# EAGLE design Clock&Timer (EAGLE 9.6.2)
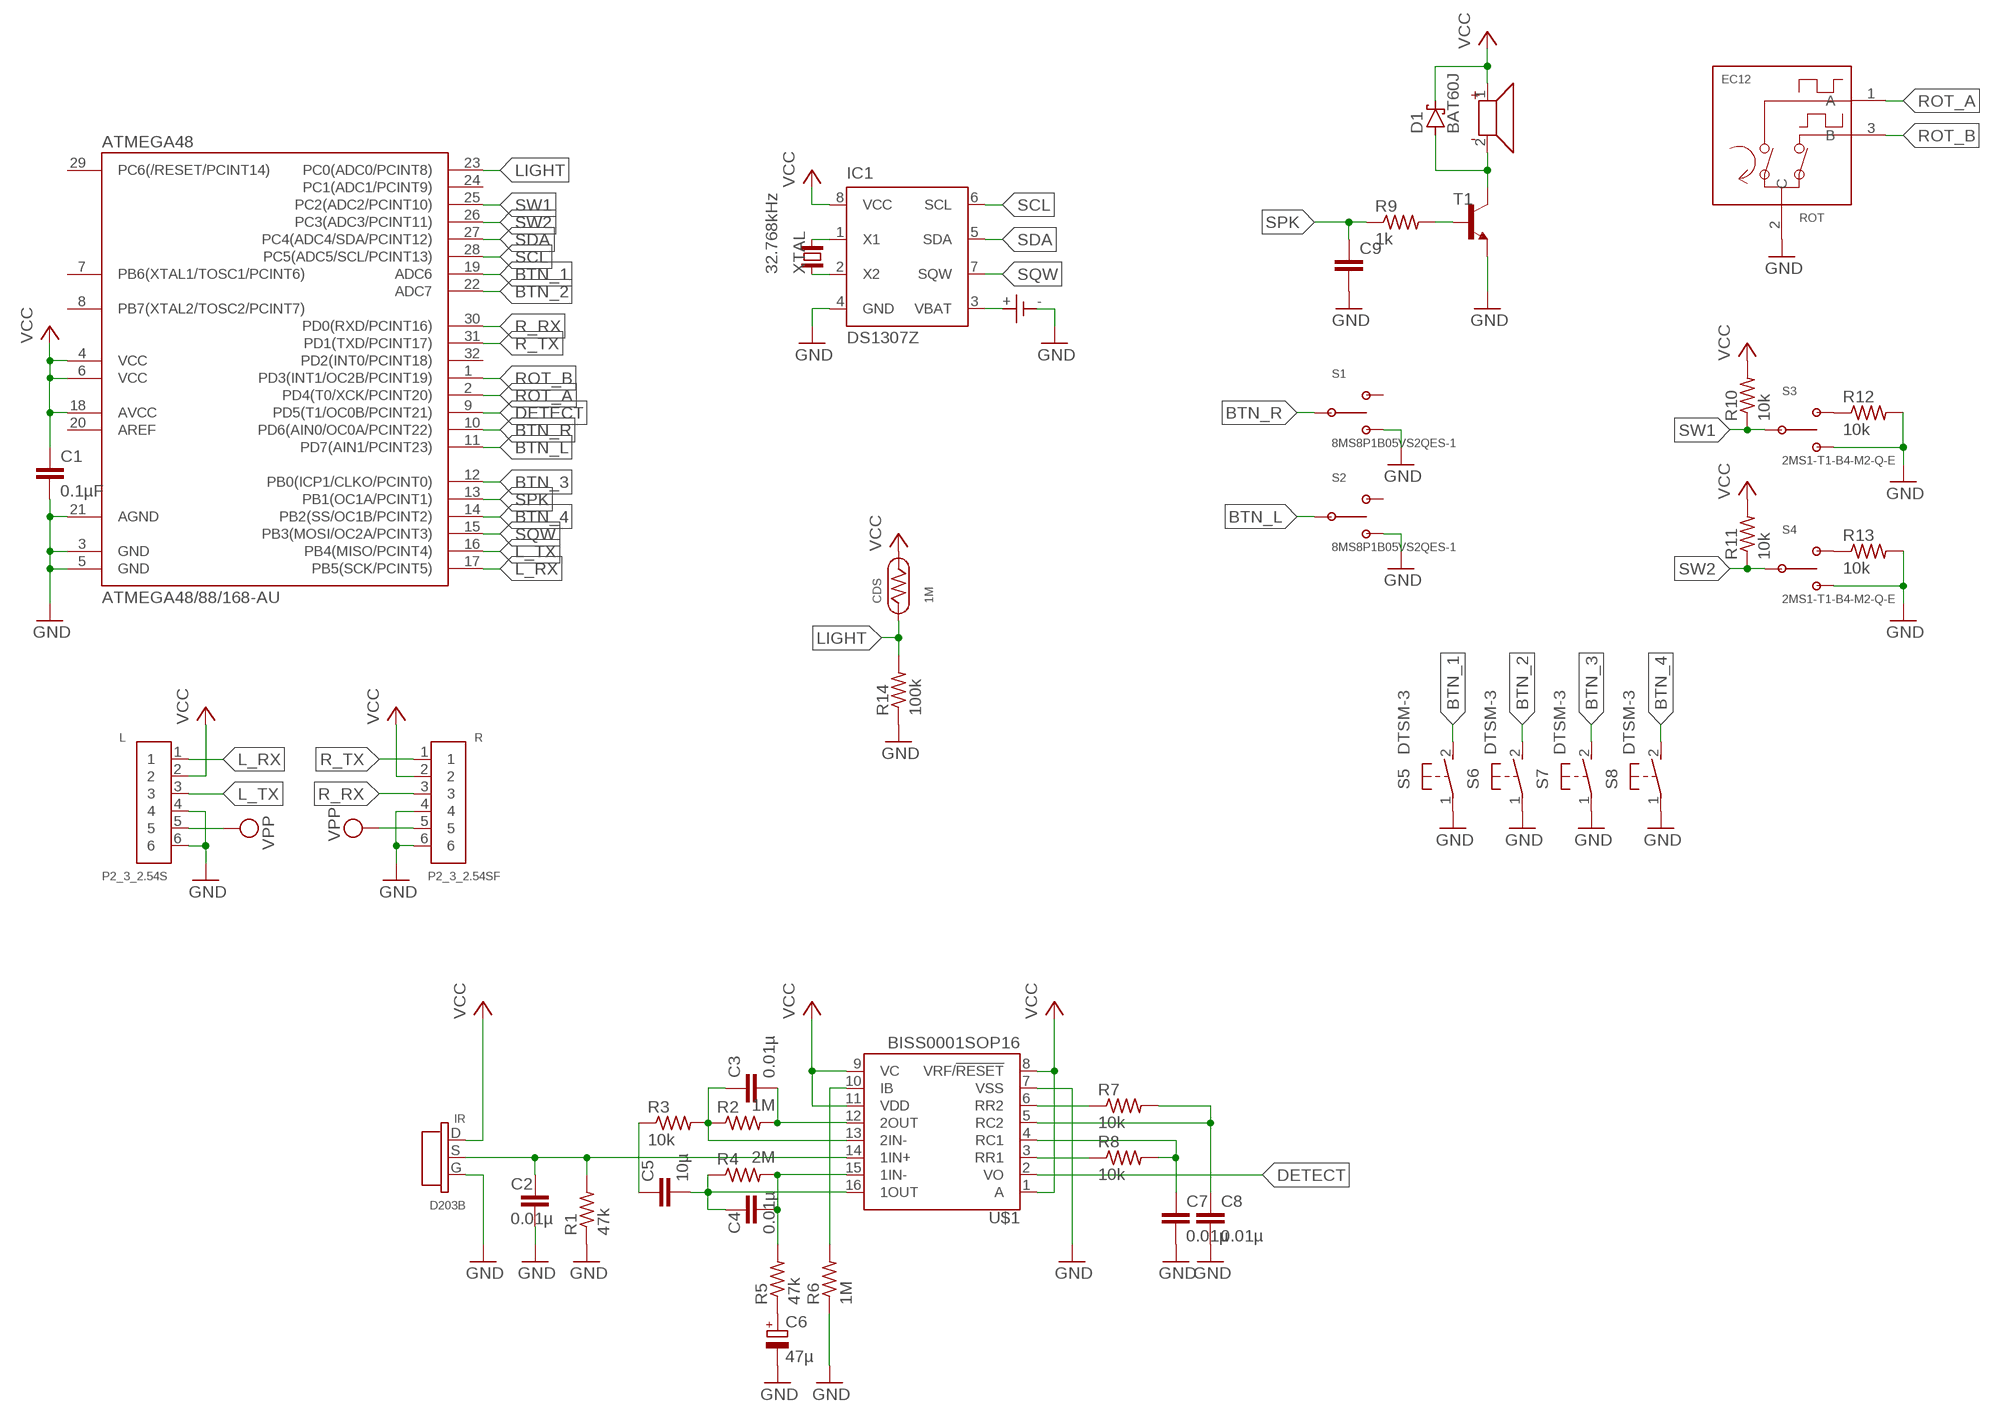
[diagram p0: schematic, sheet 1]

## Parts
ATMEGA48  ATMEGA48/88/168-AU  [TQFP32-08]
BAT  BC1/3N  [BC1/3N]
C1  0.1µF  C-EUC0603  [C0603]
C2  0.01µ  C-EUC0603  [C0603]
C3  0.01µ  C-EUC0603  [C0603]
C4  0.01µ  C-EUC0603  [C0603]
C5  10µ  C-EUC0603  [C0603]
C6  47µ  CPOL-EU153CLV-0605  [153CLV-0605]
C7  0.01µ  C-EUC0603  [C0603]
C8  0.01µ  C-EUC0603  [C0603]
C9  C-EUC0603  [C0603]
CDS  1M  GL55  [GL55]
D1  BAT60J  [SOD323_ST]
IC1  DS1307Z  [SOIC8]
IR  D203B  [D203B]
L  P2_3_2.54S  [P2_3_2.54S]
R  P2_3_2.54SF  [P2_3_2.54SF]
R1  47k  R-US_R0603  [R0603]
R2  1M  R-US_R0603  [R0603]
R3  10k  R-US_R0603  [R0603]
R4  2M  R-US_R0603  [R0603]
R5  47k  R-US_R0603  [R0603]
R6  1M  R-US_R0603  [R0603]
R7  10k  R-US_R0603  [R0603]
R8  10k  R-US_R0603  [R0603]
R9  1k  R-US_R0603  [R0603]
R10  10k  R-US_R0603  [R0603]
R11  10k  R-US_R0603  [R0603]
R12  10k  R-US_R0603  [R0603]
R13  10k  R-US_R0603  [R0603]
R14  100k  R-US_R0603  [R0603]
ROT  EC12  [EC12]
S1  8MS8P1B05VS2QES-1  [8MS8P1B05VS2QES-1]
S2  8MS8P1B05VS2QES-1  [8MS8P1B05VS2QES-1]
S3  2MS1-T1-B4-M2-Q-E  [2MS1-T1-B4-M2-Q-E]
S4  2MS1-T1-B4-M2-Q-E  [2MS1-T1-B4-M2-Q-E]
S5  DTSM-3  [DTSM-3]
S6  DTSM-3  [DTSM-3]
S7  DTSM-3  [DTSM-3]
S8  DTSM-3  [DTSM-3]
T1  -NPN-SOT23-EBC  [SOT23-EBC]
U$1  BISS0001SOP16  [SOP16]
U$9  UGCM0903EPD  [UGCM0903EPD]
XTAL  32.768kHz  CRYTALFC-255  [FC-255]

## Nets
BTN_1: ATMEGA48.19(ADC6) S5.2
BTN_2: ATMEGA48.22(ADC7) S6.2
BTN_3: ATMEGA48.12(PB0(ICP1/CLKO/PCINT0)) S7.2
BTN_4: ATMEGA48.14(PB2(SS/OC1B/PCINT2)) S8.2
BTN_L: ATMEGA48.11(PD7(AIN1/PCINT23)) S2.2(C)
BTN_R: ATMEGA48.10(PD6(AIN0/OC0A/PCINT22)) S1.2(C)
DETECT: ATMEGA48.9(PD5(T1/OC0B/PCINT21)) U$1.2(VO)
GND: ATMEGA48.3(GND) ATMEGA48.5(GND) ATMEGA48.21(AGND) BAT.-(V-) C1.2 C2.2 C6.- C7.2 C8.2 C9.2 IC1.4(GND) IR.G(GND) L.4 L.6 R1.1 R6.1 R12.2 R13.2 R14.1 R.4 R.6 ROT.2(C) S1.3(B) S2.3(B) S3.3(B) S4.3(B) S5.1 S6.1 S7.1 S8.1 T1.E U$1.7(VSS)
L_RX: ATMEGA48.17(PB5(SCK/PCINT5)) L.1
L_TX: ATMEGA48.16(PB4(MISO/PCINT4)) L.3
LIGHT: ATMEGA48.23(PC0(ADC0/PCINT8)) CDS.1 R14.2
N$1: C2.1 IR.S(OUTPUT) R1.2 U$1.14(1IN+)
N$2: C3.2 R2.2 U$1.12(2OUT)
N$3: C3.1 R2.1 R3.2 U$1.13(2IN-)
N$4: C4.2 R4.2 R5.2 U$1.15(1IN-)
N$5: C5.1 R3.1
N$6: C4.1 C5.2 R4.1 U$1.16(1OUT)
N$7: C6.+ R5.1
N$8: R6.2 U$1.10(IB)
N$9: R7.1 U$1.6(RR2)
N$10: C8.1 R7.2 U$1.5(RC2)
N$11: IC1.1(X1) XTAL.2
N$12: R8.1 U$1.3(RR1)
N$13: C7.1 R8.2 U$1.4(RC1)
N$14: D1.A T1.C U$9.2
N$15: R9.2 T1.B
N$16: IC1.2(X2) XTAL.1
N$19: R12.1 S3.1(A)
N$20: R13.1 S4.1(A)
R_RX: ATMEGA48.30(PD0(RXD/PCINT16)) R.3
R_TX: ATMEGA48.31(PD1(TXD/PCINT17)) R.1
ROT_A: ATMEGA48.2(PD4(T0/XCK/PCINT20)) ROT.1(A)
ROT_B: ATMEGA48.1(PD3(INT1/OC2B/PCINT19)) ROT.3(B)
SCL: ATMEGA48.28(PC5(ADC5/SCL/PCINT13)) IC1.6(SCL)
SDA: ATMEGA48.27(PC4(ADC4/SDA/PCINT12)) IC1.5(SDA)
SPK: ATMEGA48.13(PB1(OC1A/PCINT1)) C9.1 R9.1
SQW: ATMEGA48.15(PB3(MOSI/OC2A/PCINT3)) IC1.7(SQW)
SW1: ATMEGA48.25(PC2(ADC2/PCINT10)) R10.1 S3.2(C)
SW2: ATMEGA48.26(PC3(ADC3/PCINT11)) R11.1 S4.2(C)
VBAT: BAT.+(V+) IC1.3(VBAT)
VCC: ATMEGA48.4(VCC) ATMEGA48.6(VCC) ATMEGA48.18(AVCC) C1.1 CDS.2 D1.C IC1.8(VCC) IR.D(VIN) L.2 R10.2 R11.2 R.2 U$1.1(A) U$1.8(VRF/!RESET!) U$1.9(VC) U$1.11(VDD) U$9.1
VPP: L.5 R.5
Unconnected: ATMEGA48.7(PB6(XTAL1/TOSC1/PCINT6)) ATMEGA48.8(PB7(XTAL2/TOSC2/PCINT7)) ATMEGA48.20(AREF) ATMEGA48.24(PC1(ADC1/PCINT9)) ATMEGA48.29(PC6(/RESET/PCINT14)) ATMEGA48.32(PD2(INT0/PCINT18)) S1.1(A) S2.1(A)

## Library data of the parts
ATMEGA48 = atmega8:ATMEGA48/88/168
BAT = batteries:BC1/3N
C1 = rcl:C-EU: CAPACITOR, European symbol; SPICEPREFIX: C
C2-C5 C7-C9 = resistor:C-EU: CAPACITOR, European symbol
C6 = rcl:CPOL-EU: POLARIZED CAPACITOR, European symbol; SPICEPREFIX: C
CDS = cds:GL55
D1 = diode:BAT60J: Schottky barrier diode Source: www.st.com, BAT60J.pdf
IC1 = ds1307_pcf8583:DS1307: I2C-Bus CLOCK/CALENDAR
IR = pir:D203B
L = pins:P2_3_2.54S
R = pins:P2_3_2.54SF
R1-R8 R10-R14 = rcl:R-US_: RESISTOR, American symbol; SPICEPREFIX: R
R9 = resistor:R-US_: RESISTOR, American symbol
ROT = rotary-encoder:EC12
S1 S2 = switches:8MS8P1B05VS2QES-1
S3 S4 = switches:2MS1-T1-B4-M2-Q-E
S5-S8 = switch-tact:DTSM-3
T1 = transistor:*-NPN-: NPN Transistror BF959 corrected 2008.03.06
U$1 = pir:BISS0001
U$9 = speakers:UGCM0903EPD
XTAL = crystal':CRYTAL: CRYSTAL

## Board
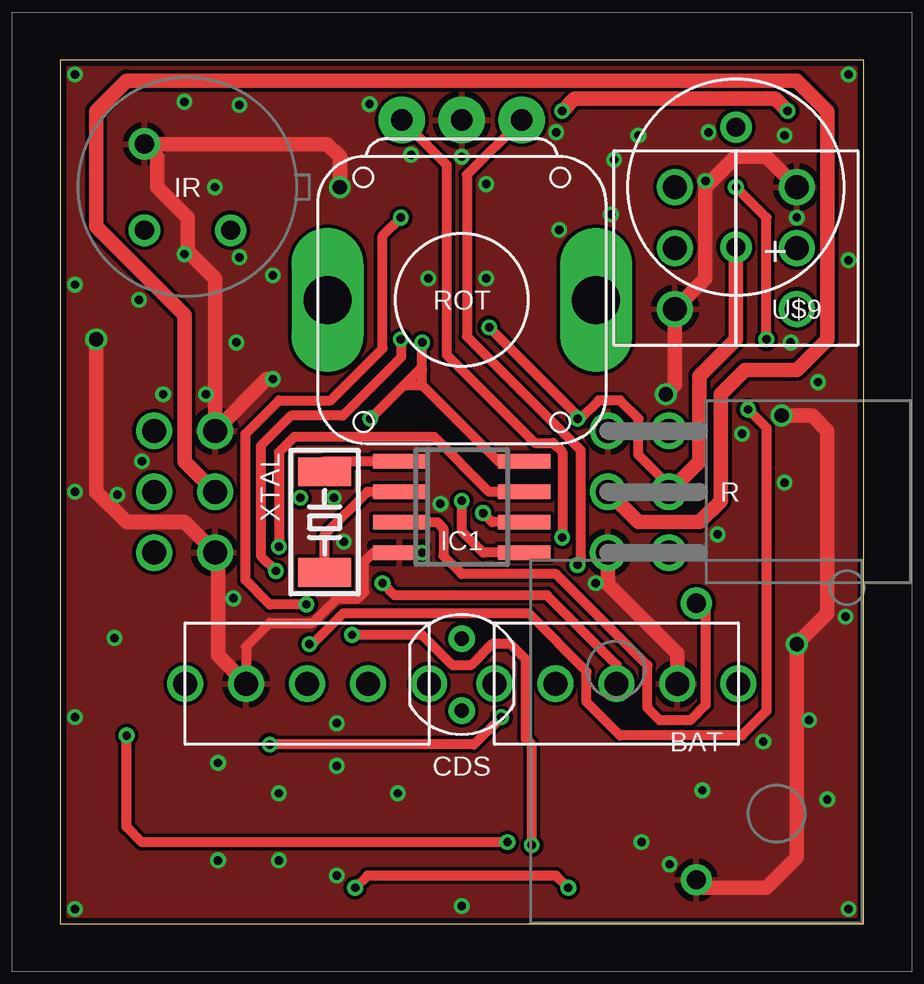
[diagram p1: board, top side]
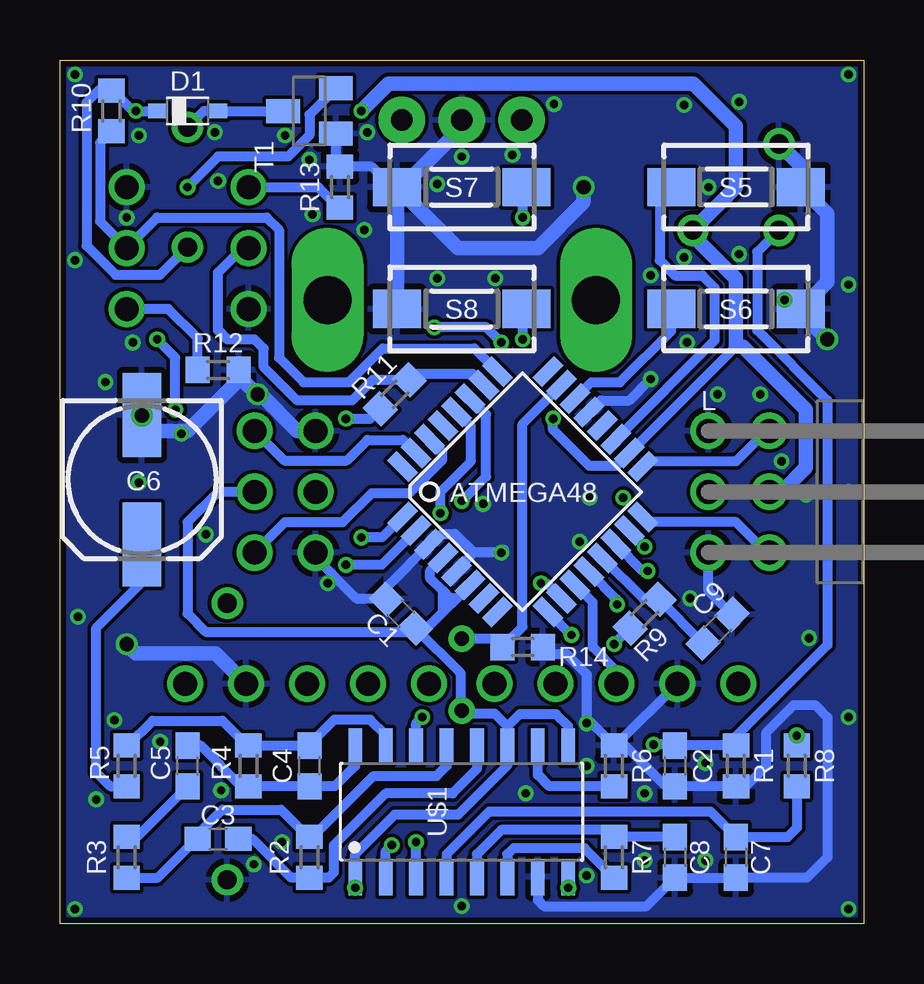
[diagram p2: board, bottom side, seen from below]

Size 33.5 x 36 mm. Coordinates in mm from the lower left corner, seen from the top.
Outline: 0,0 33.5,0 33.5,36 0,36 0,0
Copper layers (1*16): Top 0.035mm / dielectric 1.5mm / Bottom 0.035mm
Design rules "SeeedStudio_2layer_DRU_no_angle_20140221": minimum track width 6mil, minimum drill 12mil, track to track 6mil, track to pad 6mil, pad to pad 6mil, via to via 6mil, smd to smd 0mil, copper to edge 10mil, drill to drill 10mil, minimum pad ring 10mil, minimum via ring 6mil, stop-mask expansion 2mil, vias tented up to drill 100mil, thermal gap 10mil

### Footprints (pad centres in the part's own frame; a part is rotated, then mirrored left to right if it is on the bottom)
TQFP32-08 = smd 1.27 x 0.559: 1 -4.293,2.8; 2 -4.293,2; 3 -4.293,1.2; 4 -4.293,0.4; 5 -4.293,-0.4; 6 -4.293,-1.2; 7 -4.293,-2; 8 -4.293,-2.8; 17 4.293,-2.8; 18 4.293,-2; 19 4.293,-1.2; 20 4.293,-0.4; 21 4.293,0.4; 22 4.293,1.2; 23 4.293,2; 24 4.293,2.8 | smd 0.559 x 1.27: 9 -2.8,-4.293; 10 -2,-4.293; 11 -1.2,-4.293; 12 -0.4,-4.293; 13 0.4,-4.293; 14 1.2,-4.293; 15 2,-4.293; 16 2.8,-4.293; 25 2.8,4.293; 26 2,4.293; 27 1.2,4.293; 28 0.4,4.293; 29 -0.4,4.293; 30 -1.2,4.293; 31 -2,4.293; 32 -2.8,4.293
BC1/3N = drill 0.8: + -5.765,0; - 5.765,0
C0603 = smd 1.1 x 1: 1 -0.85,0; 2 0.85,0
153CLV-0605 = smd 3.5 x 1.6: + 2.7,0; - -2.7,0
GL55 = drill 0.6: 1 -1.5,0; 2 1.5,0
SOD323_ST = smd 0.8 x 0.6: A 1.25,0; C -1.25,0
SOIC8 = smd 0.6 x 2.2: 1 -1.905,-2.6; 2 -0.635,-2.6; 3 0.635,-2.6; 4 1.905,-2.6; 5 1.905,2.6; 6 0.635,2.6; 7 -0.635,2.6; 8 -1.905,2.6
D203B = drill 0.8: D -1.796,-1.796; G 1.796,1.796; S -1.796,1.796
P2_3_2.54S = drill 1: 1 0,2.54; 2 0,0; 3 0,-2.54; 4 -2.54,2.54; 5 -2.54,0; 6 -2.54,-2.54
P2_3_2.54SF = drill 1: 1 2.54,2.54; 2 2.54,0; 3 2.54,-2.54; 4 0,2.54; 5 0,0; 6 0,-2.54
R0603 = smd 1 x 1.1: 1 -0.85,0; 2 0.85,0
EC12 = drill 0.9 pad 1.93: 1 -2.5,-7.5; 2 0,-7.5; 3 2.5,-7.5 | drill 2 long: M1 -5.6,0; M2 5.6,0
8MS8P1B05VS2QES-1 = drill 1: 1 0,2.54; 2 0,0; 3 0,-2.54; G1 0,5.08; G2 0,-5.08
2MS1-T1-B4-M2-Q-E = drill 1: 1 -2.54,0; 2 0,0; 3 2.54,0
DTSM-3 = smd 2 x 1.6: 1 -2.7,0; 2 2.7,0
SOT23-EBC = smd 1 x 1.4: B 0.95,-1.1; C 0,1.1; E -0.95,-1.1
SOP16 = smd 1.509 x 0.566: 1 -2.723,4.445; 2 -2.723,3.175; 3 -2.723,1.905; 4 -2.723,0.635; 5 -2.723,-0.635; 6 -2.723,-1.905; 7 -2.723,-3.175; 8 -2.723,-4.445; 9 2.723,-4.445; 10 2.723,-3.175; 11 2.723,-1.905; 12 2.723,-0.635; 13 2.723,0.635; 14 2.723,1.905; 15 2.723,3.175; 16 2.723,4.445
UGCM0903EPD = drill 0.8: 1 0,2.5; 2 0,-2.5
FC-255 = smd 1.2 x 2.2: 1 -2.1,0; 2 2.1,0

### Placement (x,y rotation side)
ATMEGA48  14.21,18 45 bottom
BAT  26.53,7.59 270 top
C1  19.29,12.92 135 bottom
C2  7.86,6.57 270 bottom
C3  26.91,3.52 0 bottom
C4  23.1,6.57 90 bottom
C5  28.18,6.57 90 bottom
C6  30.09,18.51 270 bottom
C7  5.32,2.76 270 bottom
C8  7.86,2.76 270 bottom
C9  6.08,12.29 45 bottom
CDS  16.75,10.38 270 top
D1  28.18,33.88 0 bottom
IC1  16.75,17.36 270 top
IR  5.32,30.7 90 top
L  3.92,18 0 bottom
R  22.85,18 0 top
R1  5.32,6.57 90 bottom
R2  23.1,2.76 270 bottom
R3  30.72,2.76 270 bottom
R4  25.64,6.57 90 bottom
R5  30.72,6.57 90 bottom
R6  10.4,6.57 270 bottom
R7  10.4,2.76 90 bottom
R8  2.78,6.57 270 bottom
R9  9.13,12.92 225 bottom
R10  31.36,33.88 90 bottom
R11  19.54,22.06 225 bottom
R12  26.91,23.08 0 bottom
R13  21.83,30.7 90 bottom
R14  14.21,11.52 180 bottom
ROT  16.75,26 180 top
S1  23.2,10 90 top
S2  10.3,10 270 top
S3  30.72,28.16 90 top
S4  25.64,28.16 270 top
S5  5.32,30.7 180 bottom
S6  5.32,25.62 180 bottom
S7  16.75,30.7 0 bottom
S8  16.75,25.62 0 bottom
T1  23.1,33.88 90 bottom
U$1  16.75,4.66 90 bottom
U$9  28.18,30.7 180 top
XTAL  11.04,16.73 90 top

### Tracks (layer width: path | path; a pad name or v marks a point on that pad's centre or on a via)
BTN_1
  Bottom 0.406: S5.2 8.49,30.23 8.49,27.65 7.86,27.02 6.72,27.02 6.21,26.51 6.21,24.3 ATMEGA48.19
BTN_2
  Bottom 0.406: S6.2 8.02,24.7 10.15,22.57 11.34,22.57 | ATMEGA48.22 11.34,22.57 | ATMEGA48.22 | 11.34,22.57
BTN_3  (via drill 0.35)
  Top 0.406: v10.27,13.3 8.75,13.3 7.73,14.32 7.73,20.41 9.13,21.81 11.29,21.81 13.45,23.97 13.45,28.67 v14.21,29.43
  Bottom 0.406: S7.2 14.21,30.54 v14.21,29.43 | ATMEGA48.12 10.27,13.5 v10.27,13.3
BTN_4  (via drill 0.35)
  Top 0.406: v14.21,24.35 14.21,23.59 11.8,21.18 9.64,21.18 8.37,19.91 8.37,15.33 v9,14.7
  Bottom 0.406: S8.2 14.21,25.46 v14.21,24.35 | ATMEGA48.14 9.21,14.7 v9,14.7
BTN_L
  Bottom 0.406: S2.2 10.3,10.53 11.29,11.52 11.29,13.38 | ATMEGA48.11 11.29,13.38 | ATMEGA48.11 | 11.29,13.38
BTN_R  (via drill 0.35)
  Top 0.406: S1.2 23.2,10.79 20.31,13.68 13.96,13.68 v13.45,14.19
  Bottom 0.406: v13.45,14.19 13.23,14.19 | ATMEGA48.10 13.23,14.19 | ATMEGA48.10 | 13.23,14.19
DETECT  (via drill 0.35)
  Top 0.406: v19.67,3.27 19.67,7.46 19.42,7.71 19.42,11.02 18.78,11.65 18.02,11.65 17.13,10.76 16.37,10.76 15.1,12.03 v12.18,12.03
  Bottom 0.406: U$1.2 19.93,3.01 v19.67,3.27 | 12.56,12.39 12.2,12.03 v12.18,12.03 | ATMEGA48.9 12.56,12.39 | 12.56,12.39
GND  (via drill 0.35, 0.6)
  Top 0.406: S2.3 7.76,11.55 8.75,12.54 10.53,12.54 11.54,13.55 12.43,13.55 12.69,13.81 12.69,15.08 13.07,15.46 IC1.4 v15.1,15.46 15.18,15.46
  Top 0.61: R.6 22.85,14.16 25.74,11.27 S1.3 | v11.67,30.7 11.67,31.97 11.14,32.5 IR.G 4.05,31.97 4.05,30.7 5.32,29.43 5.32,28.03 6.46,26.89 L.4 8.62,22.7 v8.88,22.7 | v1.51,24.35 1.51,18 2.78,16.73 5.19,16.73 L.6 6.59,15.33 6.59,11.17 S2.3 | v30.09,21.18 31.36,21.18 31.99,20.54 31.99,12.92 v30.72,11.65 30.72,2.76 29.45,1.49 26.86,1.49 BAT.- | S3.3 29.45,31.97 28.18,31.97 26.91,30.7 26.91,26.89 S4.3 25.64,22.45 v25.26,22.06
  Bottom 0.406: U$1.7 13.57,0.98 13.32,0.73 9.04,0.73 C8.2 C7.2 2.36,1.91 1.51,2.76 1.51,8.6 2.02,9.11 2.91,9.11 4.05,7.97 4.05,6.57 4.9,5.72 R1.1 C2.2 8.24,5.72 9.94,7.42 R6.1 | ATMEGA48.5 | ATMEGA48.21 | S2.3 10.34,7.42 R6.1 | 16.24,15.46 16.96,14.74 ATMEGA48.5 | C9.2 6.46,13.87 L.6 | ATMEGA48.21 10.97,21.81 9.77,21.81 v8.88,22.7 | C1.2 19.89,14.02 ATMEGA48.3 17.99,15.81 17.56,16.25 17.03,16.25 16.24,15.46 | R14.1 13.07,11.24 12.38,11.24 11.54,10.4 11.54,8.56 R6.1 | T1.E 22,31.72 R13.2 20.5,31.55 19.65,30.7 S7.1 | R.6 22.85,15.26 21.15,13.56 19.93,13.56 C1.2 | C1.2 | 16.24,15.46 v15.1,15.46 14.97,15.59
  Bottom 0.61: S7.1 19.25,30.7 16.75,33.2 ROT.2 | S7.1 S8.1 | R.4 23.61,20.54 25.13,22.06 v25.26,22.06 25.3,22.06 26.06,22.83 R12.2 26.06,22.66 28.18,20.54 29.42,20.54 C6.- 30.09,22.3 | IR.G 2.62,31.59 S5.1 1.51,29.59 1.51,26.73 S6.1 2.62,25.46 v1.51,24.35 | S7.1 16.91,28.16 13.57,28.16 11.67,30.06 v11.67,30.7 | S1.3 27.01,11.27 30.34,11.27 v30.72,11.65
  other vias: 32.88,35.4 30.21,32.86 27.04,32.99 26.91,30.95 30.72,29.43 32.88,27.65 24.12,32.86 23.1,31.84 20.69,32.99 12.91,34.16 14.64,32.05 16.75,31.97 17.77,30.83 15.35,26.89 17.77,26.89 8.88,27.02 7.48,27.78 6.46,30.7 7.48,34.13 5.19,34.26 0.62,35.4 0.62,26.64 5.19,27.91 7.35,24.22 6.08,22.06 4.3,22.06 3.41,19.27 0.62,18 2.4,17.87 2.27,11.9 0.62,8.6 0.62,0.6 6.59,2.63 9.13,2.63 11.54,2 16.75,0.73 14.08,5.43 9.13,5.43 6.59,6.7 11.54,6.57 11.54,8.35 24.24,3.39 25.41,2.47 32.88,0.6 31.99,5.17 31.23,8.47 29.32,7.59 26.78,5.55 32.75,12.79 27.42,16.22 30.21,18.38 22.34,14.19 28.43,20.41 31.61,22.57 30.47,24.22 20.81,28.92 22.97,29.56 15.86,17.49 11.42,17.75 11.84,15.92 7.22,13.55 3.29,26
  pour Top: -1.03,37.05 34.53,37.05 34.53,-1.05 -1.03,-1.05
  pour Bottom: -2.3,38.32 35.8,38.32 35.8,-2.32 -2.3,-2.32
L_RX
  Bottom 0.406: L.1 4.05,20.54 5.32,19.27 8.98,19.27 ATMEGA48.17
L_TX
  Bottom 0.406: L.3 4.05,15.46 5.32,16.73 8.98,16.73 ATMEGA48.16
LIGHT
  Bottom 0.406: CDS.1 15.42,11.88 R14.2 14.21,12.37 14.21,20.83 ATMEGA48.23 | ATMEGA48.23
N$1  (via drill 0.35)
  Top 0.406: v18.4,8.6 17.26,7.46 v8.75,7.46
  Bottom 0.406: IR.S 4.43,28 4.43,24.73 1.51,21.81 1.51,11.61 5.32,7.8 R1.2 C2.1 7.9,7.46 v8.75,7.46 | U$1.14 18.66,8.35 v18.4,8.6
N$2
  Bottom 0.406: U$1.12 16.11,6.44 17.13,5.43 19.93,5.43 22.08,3.27 22.08,2.12 22.3,1.91 R2.2 23.86,1.91 25.47,3.52 C3.2
N$3
  Bottom 0.406: U$1.13 17.39,6.57 17.8,6.16 20.43,6.16 22.97,3.61 R2.1 23.15,3.61 24.29,4.75 26.74,4.75 27.76,3.73 C3.1 27.81,3.52 29.42,1.91 R3.2
N$4
  Bottom 0.406: U$1.15 19.93,7.86 20.56,8.5 22.07,8.5 23.1,7.47 C4.2 R4.2 25.69,7.42 26.72,8.45 29.64,8.45 30.67,7.42 R5.2
N$5
  Bottom 0.406: C5.1 30.29,3.61 R3.1
N$6
  Bottom 0.406: C5.2 27.64,7.42 25.94,5.72 R4.1 C4.1 22.05,5.72 21.2,6.57 U$1.16
N$7
  Bottom 0.406: C6.+ 30.09,14.22 32.01,12.3 32.01,6.32 31.41,5.72 R5.1
N$8
  Bottom 0.406: R6.2 13.11,5.72 13.57,6.19 U$1.10
N$9
  Bottom 0.406: R7.1 11.63,3.14 14.59,3.14 14.85,2.89 U$1.6
N$10
  Bottom 0.406: U$1.5 16.11,2.89 15.1,3.9 10.69,3.9 R7.2 C8.1
N$11
  Top 0.406: IC1.1 11.04,19.27 XTAL.2
N$12  (via drill 0.35)
  Top 0.406: v18.66,3.39 3.41,3.39 2.78,4.03 v2.78,7.84
  Bottom 0.406: U$1.3 v18.66,3.39 | R8.1 v2.78,7.84
N$13
  Bottom 0.406: U$1.4 17.39,2.89 15.61,4.66 6.38,4.66 C7.1 3.16,3.61 2.78,3.99 R8.2
N$14
  Bottom 0.406: U$9.2 27.51,33.88 D1.A T1.C
N$15  (via drill 0.35)
  Top 0.406: v28.69,21.43 29.45,20.67 29.45,8.86 28.43,7.84 23.35,7.84 21.96,9.24 21.96,10.51 19.54,12.92 11.8,12.92 10.53,11.65 v10.4,11.65 | v29.45,24.35 29.45,29.43 v28.18,30.7
  Bottom 0.406: R9.2 v10.4,11.65 | v28.69,21.43 28.69,23.59 v29.45,24.35 | T1.B 23.1,33.73 23.1,32.86 23.99,31.97 26.91,31.97 v28.18,30.7
N$16
  Top 0.406: XTAL.1 11.04,16.22 12.81,18 IC1.2
N$19
  Bottom 0.406: R12.1 27.76,24.4 28.98,25.62 S3.1
N$20
  Bottom 0.406: S4.1 22.73,30.7 21.88,29.85 R13.1
N$78  (via drill 0.35)
  other vias: 10.02,17.75
R_RX
  Bottom 0.406: R.3 24.12,16.73 21.71,16.73 20.5,17.95 18.93,17.95 17.55,19.32 17.55,19.65 ATMEGA48.30 | ATMEGA48.30
R_TX
  Bottom 0.406: R.1 24.15,19.3 21.54,19.3 20.68,20.16 19.2,20.16 ATMEGA48.31 | ATMEGA48.31
ROT_A  (via drill 0.35)
  Top 0.406: ROT.1 16.96,31.21 16.96,24.48 21.7,19.74 21.7,15.08 v21.58,14.95
  Bottom 0.406: ATMEGA48.2 20.09,14.95 v21.58,14.95
ROT_B  (via drill 0.35)
  Top 0.406: ROT.3 16.11,31.63 16.11,23.71 19.8,20.03 20.56,20.03 20.94,19.65 v20.94,16.09
  Bottom 0.406: ATMEGA48.1 20.07,16.09 v20.94,16.09
SCL  (via drill 0.35)
  Top 0.406: IC1.6 18.02,16.73 v17.64,17.11
  Bottom 0.406: v17.64,17.11 17.64,18 16.37,19.27 16.37,20.73 ATMEGA48.28
SDA  (via drill 0.35)
  Top 0.406: IC1.5 17.64,15.46 16.75,16.35 v16.75,17.62
  Bottom 0.406: v16.75,17.62 15.73,18.64 15.73,21.22 ATMEGA48.27
SPK
  Bottom 0.406: C9.1 6.69,11.68 R9.1 | R9.1 | R9.1 9.16,13.52 ATMEGA48.13 | R9.1 | ATMEGA48.13
SQW  (via drill 0.35)
  Top 0.406: IC1.7 17.89,18 15.61,20.29 9.77,20.29 9.13,19.65 v9.13,15.71
  Bottom 0.406: ATMEGA48.15 9.76,16.34 v9.13,15.71
SW1
  Bottom 0.406: R10.1 31.83,32.55 31.83,29.27 S3.2 29.45,29.43 24.88,29.43 24.37,28.92 24.37,23.59 23.35,22.57 21.45,22.57 20.05,23.97 16.22,23.97 ATMEGA48.25
SW2
  Bottom 0.406: ATMEGA48.26 16.3,22.92 18.69,22.92 R11.1 20.47,22.66 21.32,21.81 23.61,21.81 25.01,23.21 25.01,23.97 25.39,24.35 26.53,24.35 26.91,24.73 26.91,27.14 25.89,28.16 S4.2 | ATMEGA48.26
VBAT
  Top 0.406: BAT.+ 26.91,12.97 26.91,9.11 26.27,8.47 25.01,8.47 24.5,8.98 24.5,10.76 20.69,14.57 16.75,14.57 15.99,15.33 15.99,16.48 15.73,16.73 IC1.3
VCC  (via drill 0.35)
  Top 0.406: v21.2,1.49 20.69,2 12.81,2 v12.3,1.49 | R.2 25.39,18.25 24.12,19.52 24.12,21.05 23.35,21.81 22.46,21.81 21.7,21.05 | 21.7,21.05 v21.58,21.05 | IC1.8 18.27,19.27 15.1,22.45 | 15.1,22.45 15.1,23.08 | 15.1,23.08 v15.1,24.22 | v17.89,24.86 21.7,21.05 | v12.94,21.05 14.34,22.45 | 14.34,22.45 15.1,22.45 | 14.34,22.45 14.97,23.08 15.1,23.08
  Top 0.61: R.2 26.66,19.27 26.66,22.83 28.18,24.35 U$9.1 | v30.34,33.88 29.83,34.38 21.45,34.38 v20.94,33.88
  Bottom 0.406: U$1.11 14.85,6.6 16.91,4.54 19.54,4.54 21.2,2.89 U$1.1 v21.2,1.49 | U$1.9 12.3,8.22 12.81,8.73 14.34,8.73 14.85,8.22 | 14.85,8.22 U$1.11 | ATMEGA48.6 16.94,13.58 | 16.94,13.58 17.26,13.58 17.56,13.88 | 17.56,13.88 18.07,14.38 18.07,14.71 ATMEGA48.4 | ATMEGA48.4 | U$1.11 14.85,7.7 | ATMEGA48.18 5.32,24.06 | 16.4,14.16 ATMEGA48.6 | 16.94,13.58 17.55,12.96 17.56,12.97 | 17.56,13.88 17.56,12.97 | U$1.8 v12.3,1.49 | C1.1 16.83,10.46 16.81,10.46 16.81,8.94 CDS.2 16.62,8.75 15.38,8.75 14.85,8.22 | C1.1 18.21,12.32 17.56,12.97 | v21.58,21.05 20.56,21.05 R11.2 | D1.C v30.34,33.88 30.45,33.88 31.3,34.73 R10.2 31.9,34.73 32.39,34.24 32.39,28.26 31.18,27.05 29.33,27.05 U$9.1 | ATMEGA48.6 | ATMEGA48.18 10.3,19.08 11.43,19.08 12.94,20.59 v12.94,21.05 | ATMEGA48.18 | R.2 26.91,18 28.18,16.73 28.18,12.92 27.42,12.16 18.85,12.16 C1.1 | v15.1,24.22 15.73,24.86 v17.89,24.86
  Bottom 0.61: L.2 3.41,18 2.4,19.02 2.4,21.43 5.03,24.06 5.32,24.06 5.32,26.89 7.12,28.69 IR.D 5.32,30.7 5.32,33.24 7.1,35.02 19.8,35.02 v20.94,33.88
VPP
  Top 0.61: L.5 5.19,19.27 5.19,25.37 1.51,29.05 1.51,33.88 2.78,35.14 30.72,35.14 31.99,33.88 31.99,24.35 30.72,23.08 28.56,23.08 27.55,22.06 27.55,17.62 26.66,16.73 24.12,16.73 R.5

### Text on the board
tStop: Designed by @fujiy0, 2020